# Altium schematic sheet Zusammenbau.SchDoc
size A0; SheetNumber: 1; SheetTotal: 3
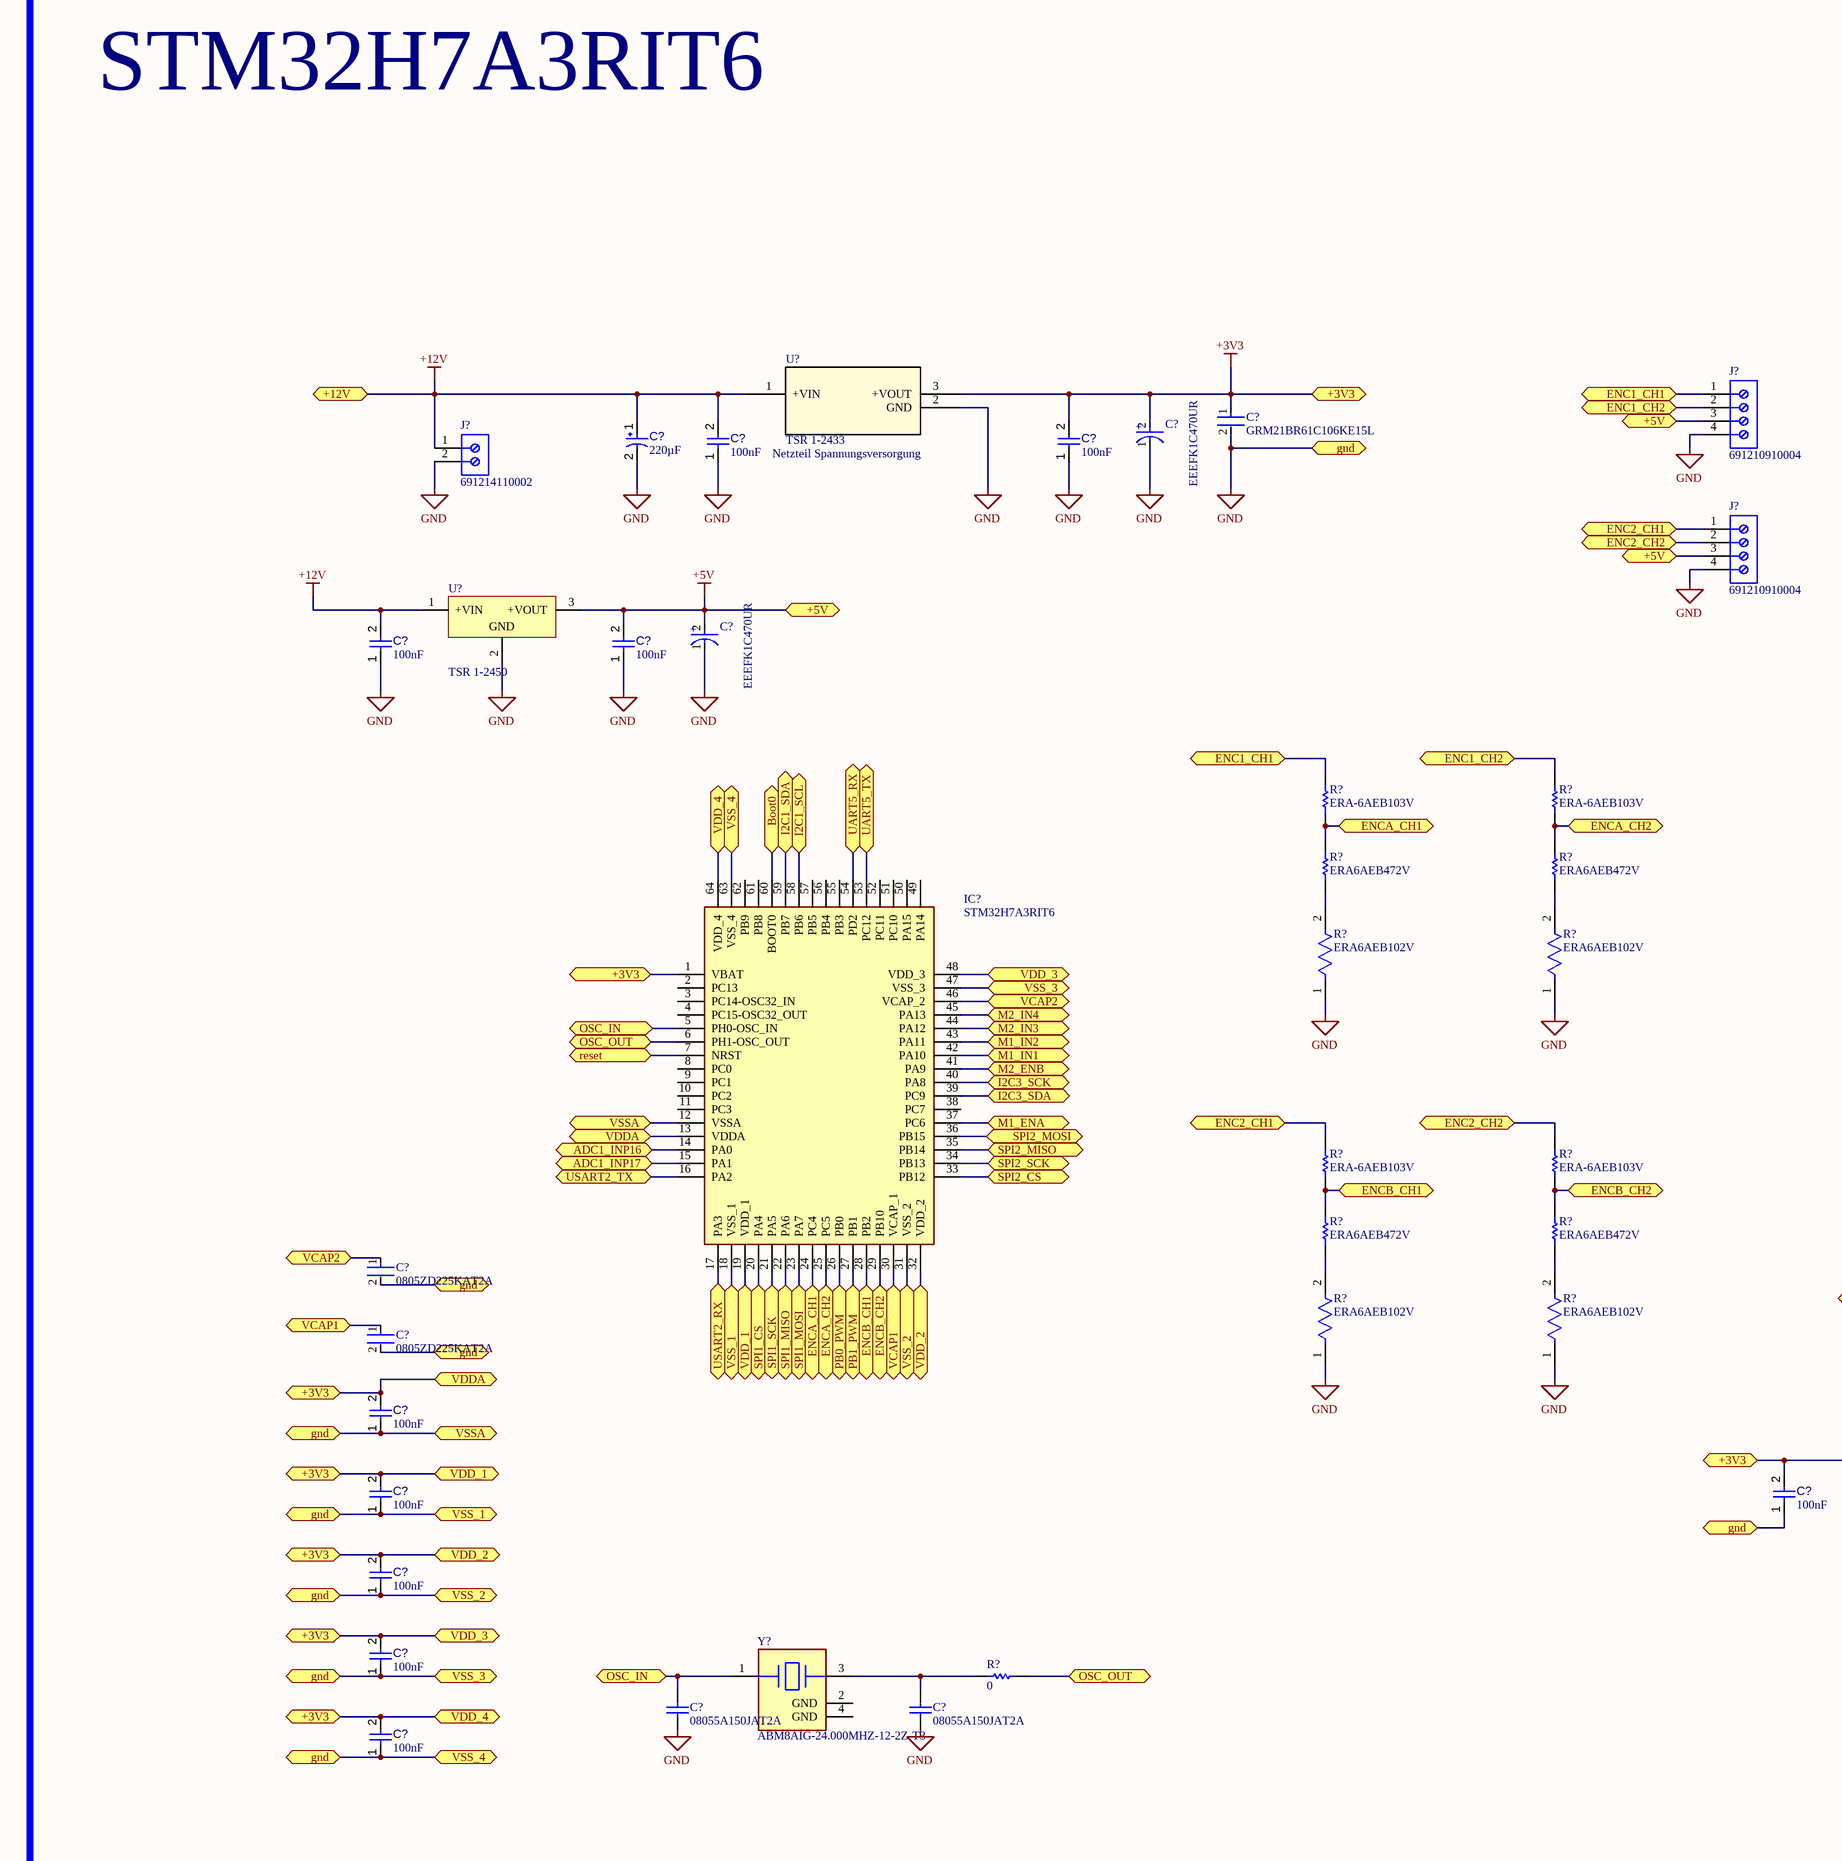
[diagram p0: Zusammenbau.SchDoc, left]
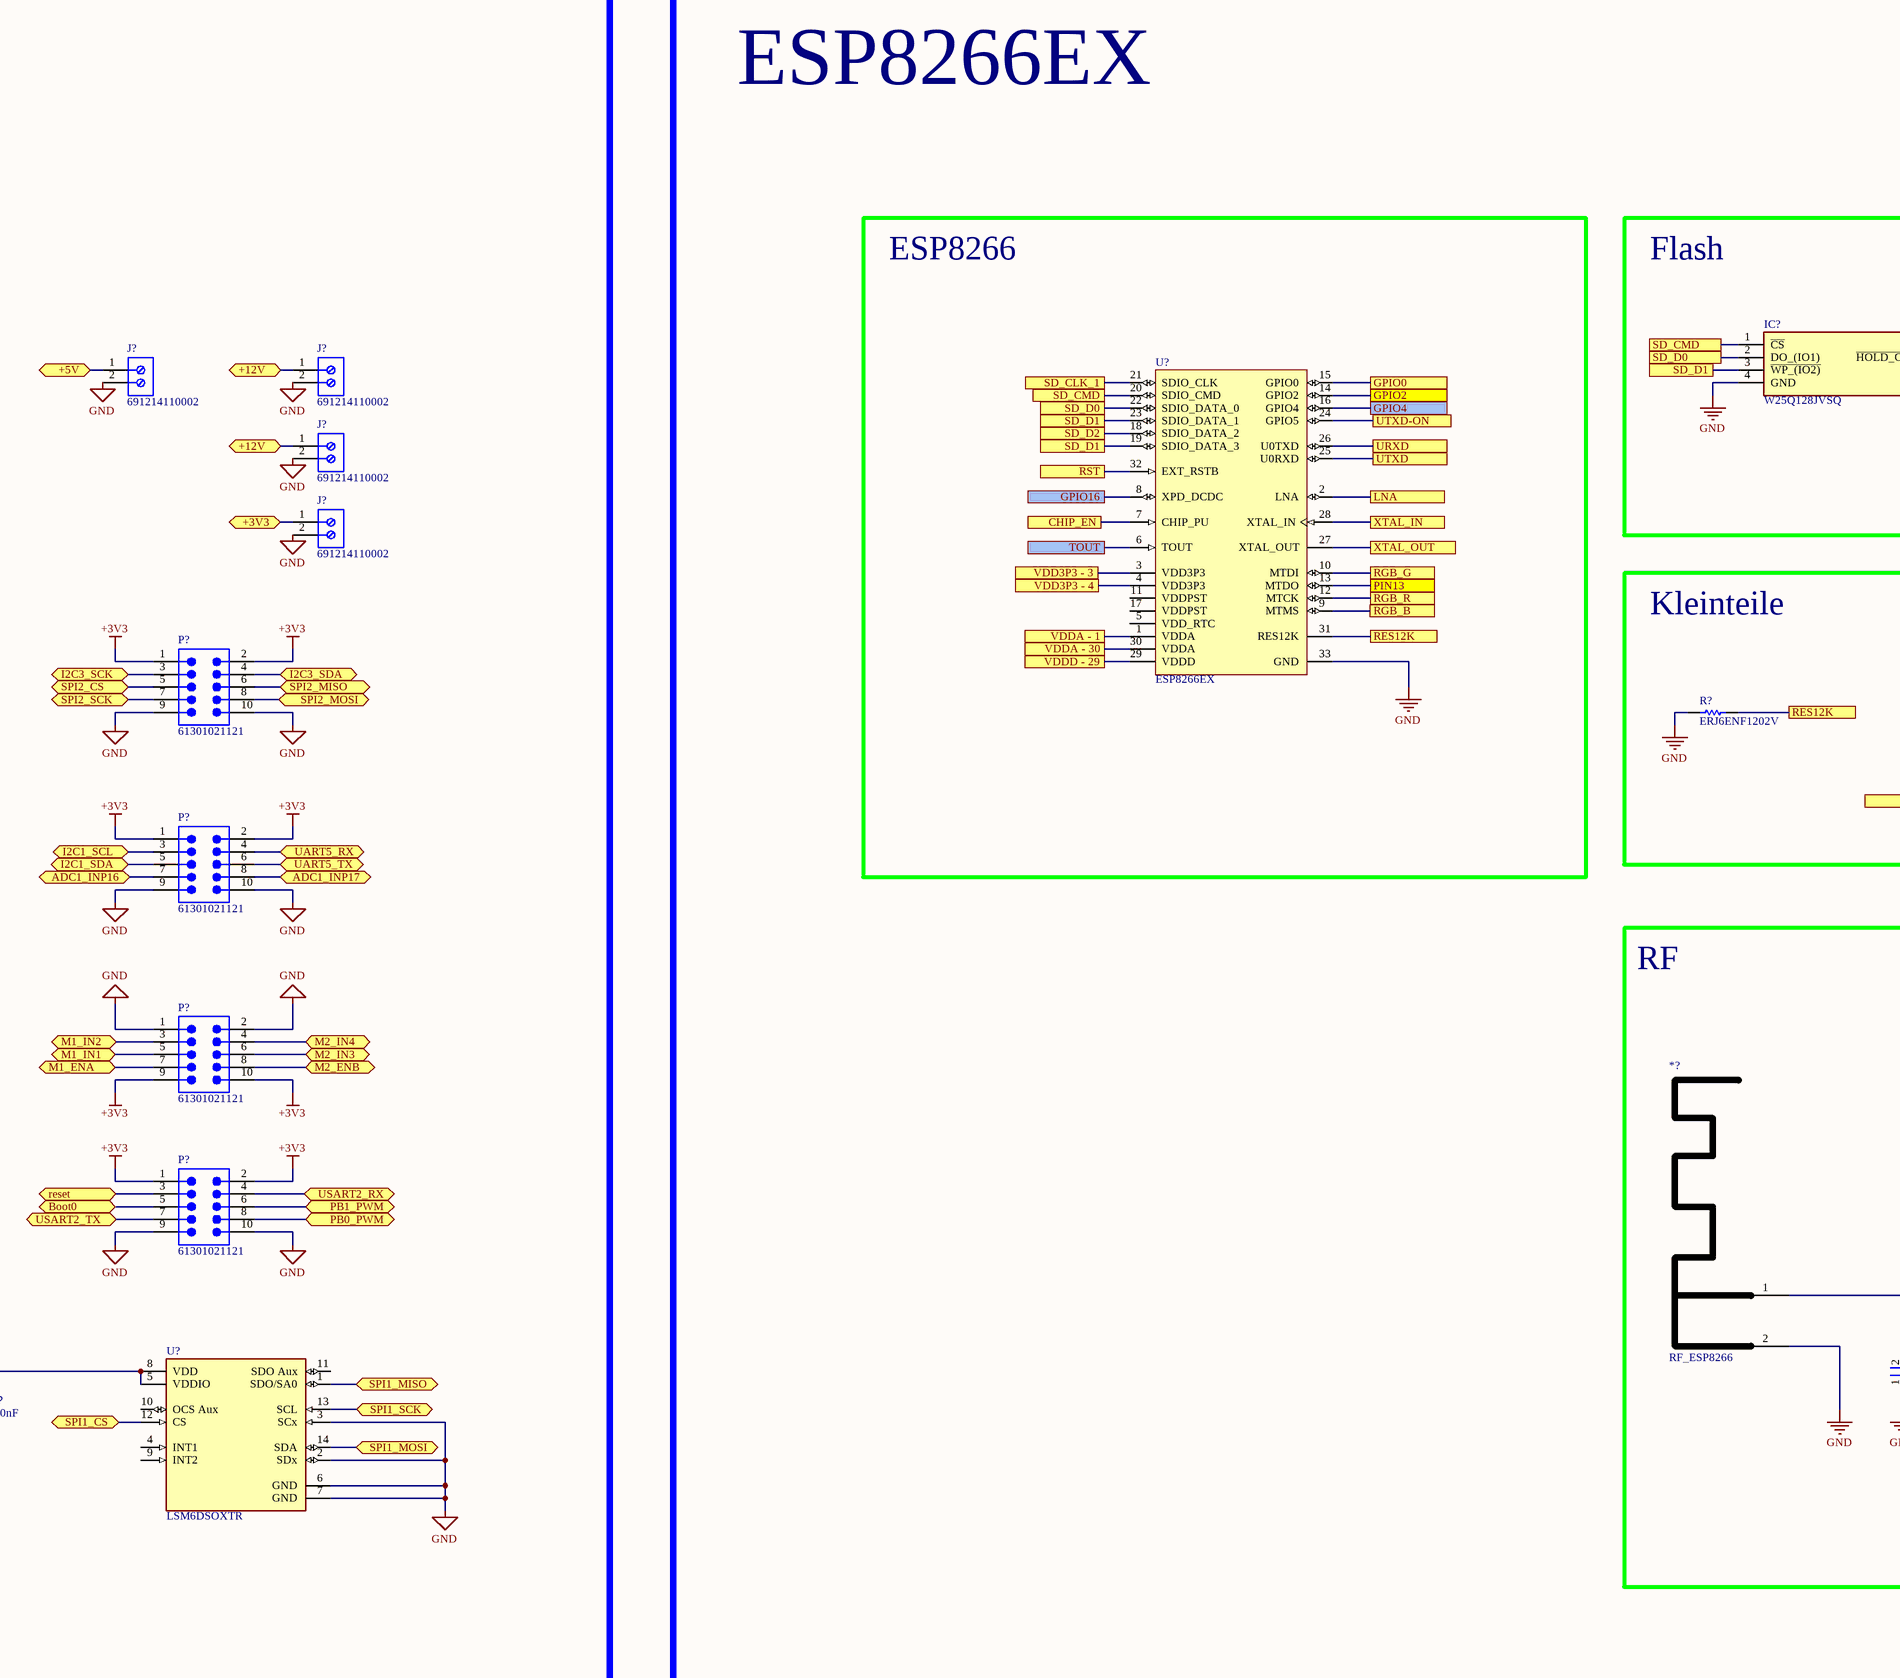
[diagram p1: Zusammenbau.SchDoc, middle]
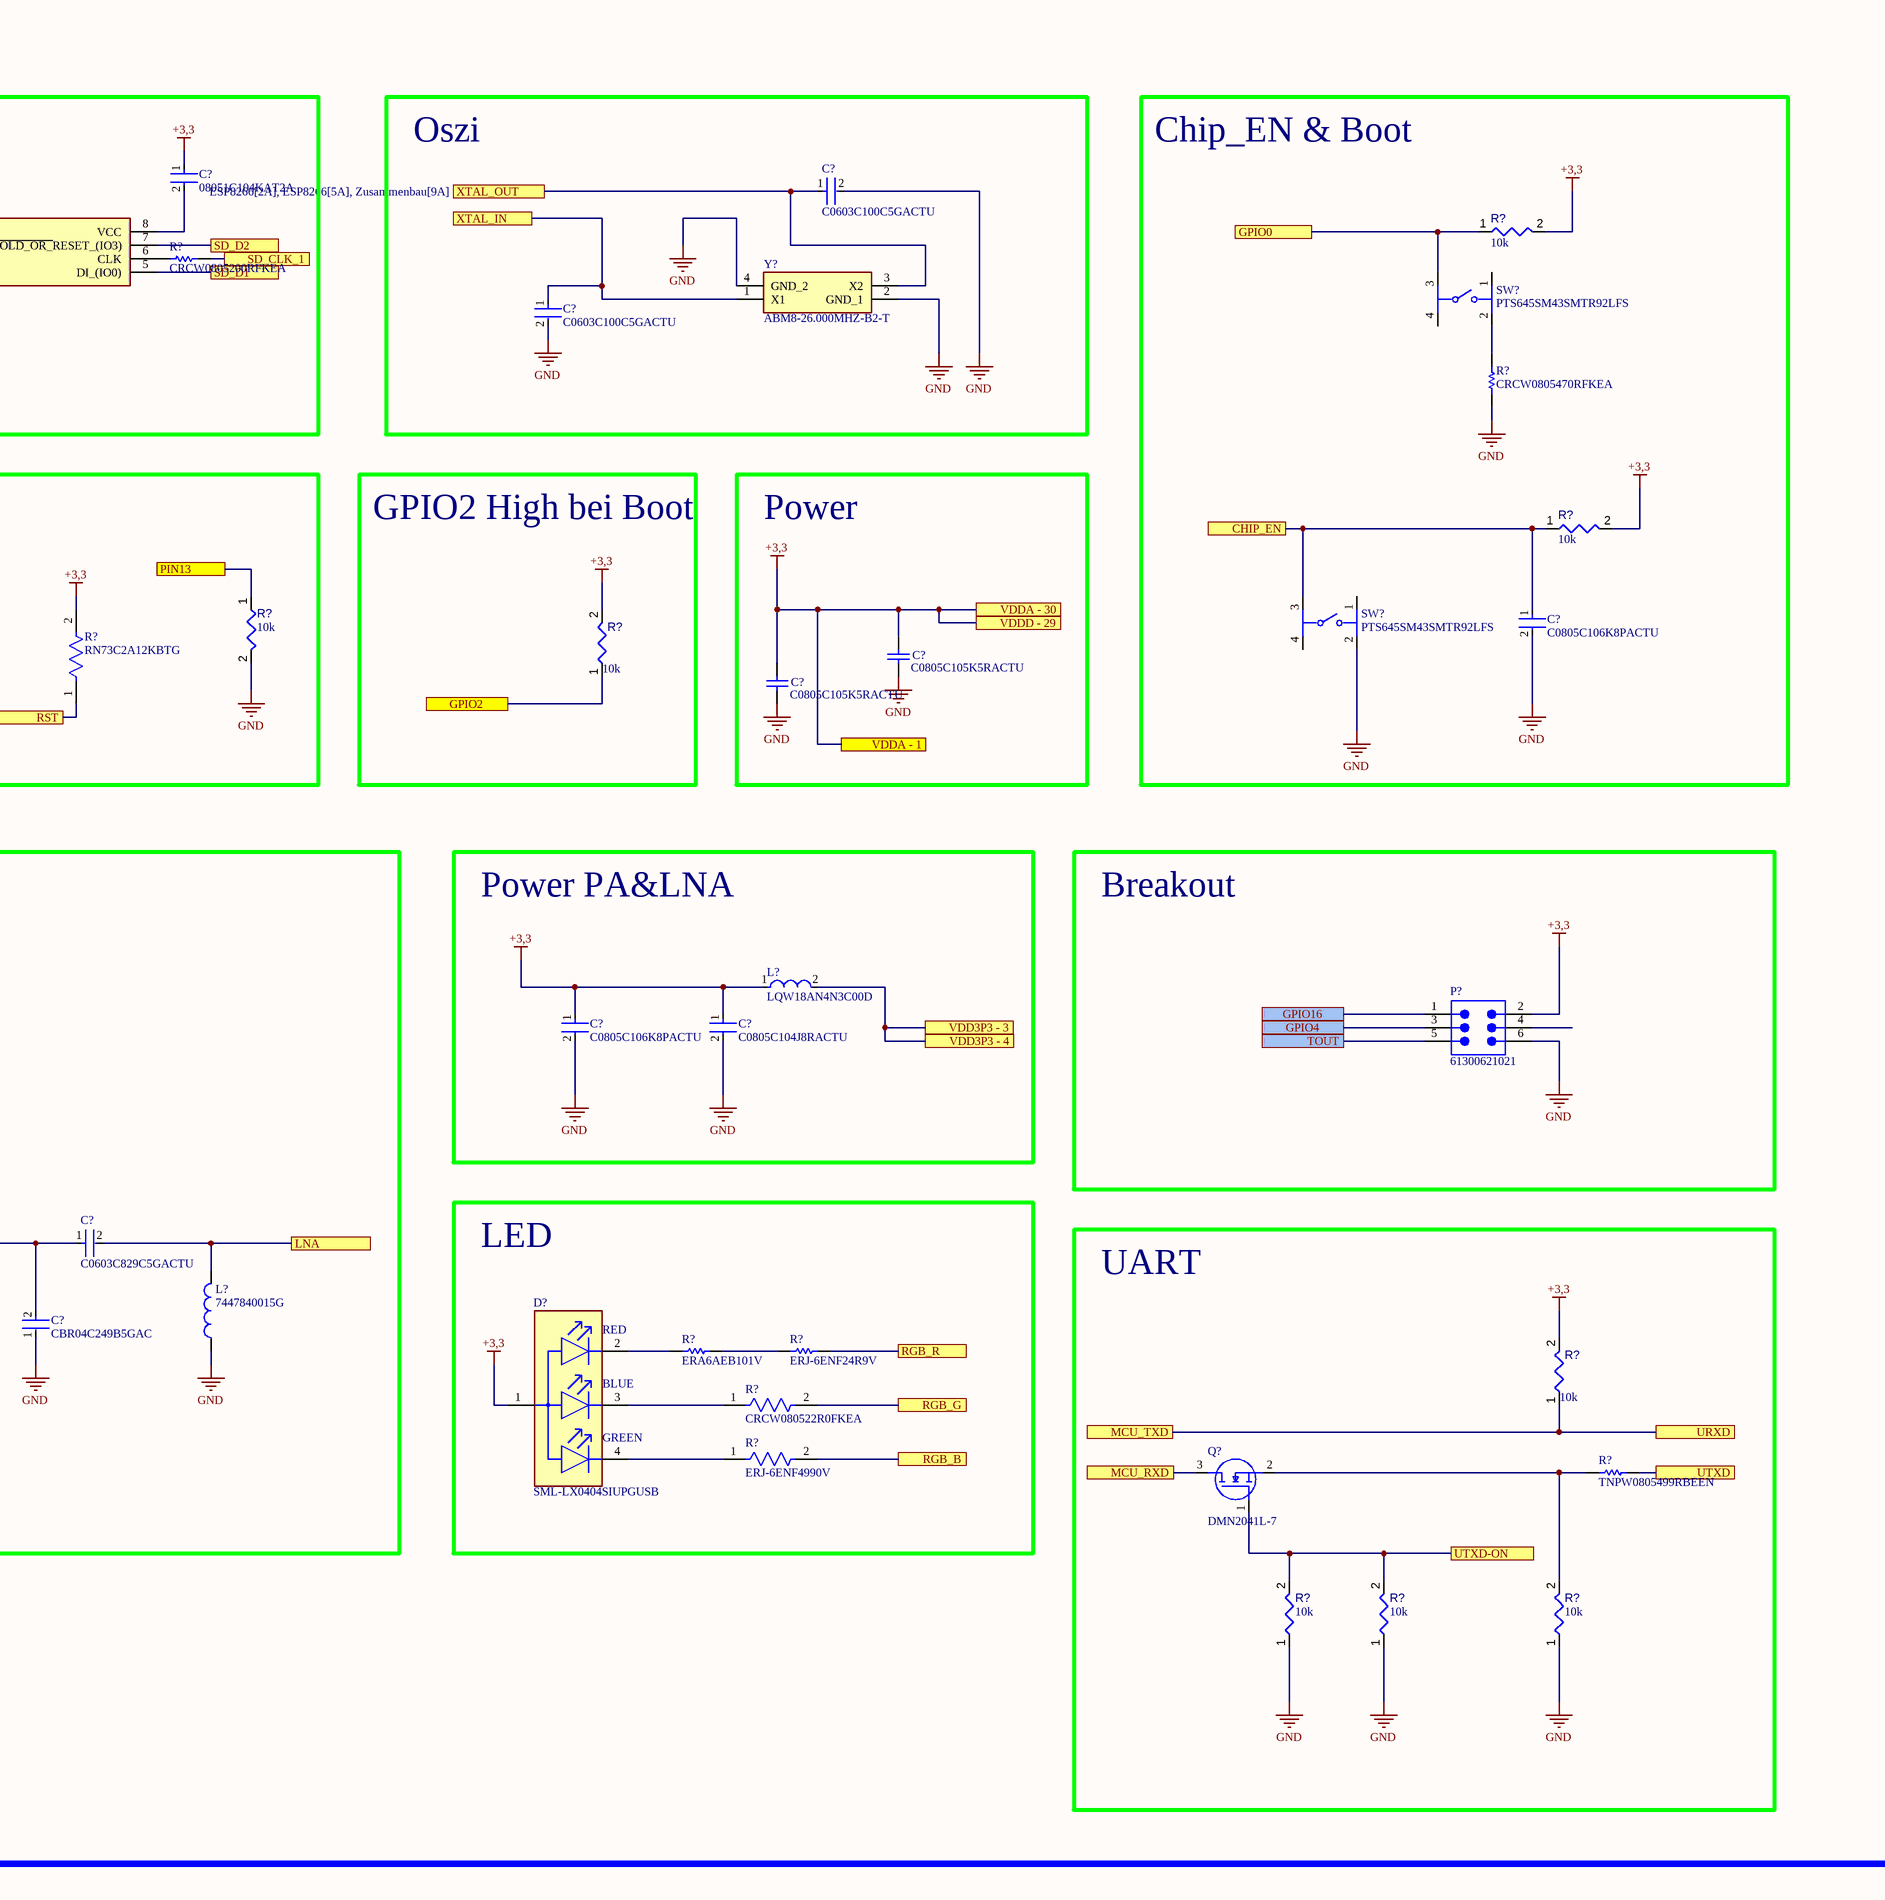
[diagram p2: Zusammenbau.SchDoc, right]

## Parts
(Parts that share a designator on the sheet are numbered #1, #2 ... from top to bottom, then left to right.)
*?  RF_ESP8266  [PCBComponent_1]
C?#1  08051C104KAT2A  [FP-0805-L_2_01_0_2-W_1_25-IPC_B]
C?#2  C0603C100C5GACTU  [FP-C0603C-CF-MFG]
C?#3  GRM21BR61C106KE15L  [FP-GRM21B-0_1-IPC_C]
C?#4  value 220µF  [CAPPR65-500-1250X1000X1350]  (hidden comment: ECA-1HM221)
C?#5  EEEFK1C470UR  [FP-FKC-MFG]
C?#6  C0603C100C5GACTU  [FP-C0603C-CF-MFG]
C?#7  value 100nF  [CAPC2013X95X50LL10T25]  (hidden comment: Capacitor 100 nF +/-10% 50 V 0805)
C?#8  value 100nF  [CAPC2013X95X50LL10T25]  (hidden comment: Capacitor 100 nF +/-10% 50 V 0805)
C?#9  EEEFK1C470UR  [FP-FKC-MFG]
C?#10  value 100nF  [CAPC2013X95X50LL10T25]  (hidden comment: Capacitor 100 nF +/-10% 50 V 0805)
C?#11  value 100nF  [CAPC2013X95X50LL10T25]  (hidden comment: Capacitor 100 nF +/-10% 50 V 0805)
C?#12  C0805C106K8PACTU  [FP-C0805C-DG-MFG]
C?#13  C0805C105K5RACTU  [CAPC2013X140X50ML20T25]
C?#14  C0805C105K5RACTU  [CAPC2013X140X50ML20T25]
C?#15  C0805C106K8PACTU  [FP-C0805C-DG-MFG]
C?#16  C0805C104J8RACTU  [FP-C0805C-DN-MFG]
C?#17  0805ZD225KAT2A  [FP-0805-L_2_01_0_2-W_1_25-IPC_B]
C?#18  0805ZD225KAT2A  [FP-0805-L_2_01_0_2-W_1_25-IPC_B]
C?#19  C0603C829C5GACTU  [FP-C0603C-CF-MFG]
C?#20  value 100nF  [CAPC2013X95X50LL10T25]  (hidden comment: Capacitor 100 nF +/-10% 50 V 0805)
C?#21  CBR04C249B5GAC  [FP-CBR04C-MFG]
C?#22  value 100nF  [CAPC2013X95X50LL10T25]  (hidden comment: Capacitor 100 nF +/-10% 50 V 0805)
C?#23  value 100nF  [CAPC2013X95X50LL10T25]  (hidden comment: Capacitor 100 nF +/-10% 50 V 0805)
C?#24  value 100nF  [CAPC2013X95X50LL10T25]  (hidden comment: Capacitor 100 nF +/-10% 50 V 0805)
C?#25  value 100nF  [CAPC2013X95X50LL10T25]  (hidden comment: Capacitor 100 nF +/-10% 50 V 0805)
C?#26  08055A150JAT2A  [CAPC2013X140X50LL20T25]
C?#27  08055A150JAT2A  [CAPC2013X140X50LL20T25]
C?#28  value 100nF  [CAPC2013X95X50LL10T25]  (hidden comment: Capacitor 100 nF +/-10% 50 V 0805)
D?  SML-LX0404SIUPGUSB  [FP-SML-LX0404SIUPGUSB-MFG]
IC?#1  W25Q128JVSQ  [SOIC127P790X216-8N]
IC?#2  STM32H7A3RIT6  [QFP50P1200X1200X160-64N]
J?#1  691210910004  [691210910004]
J?#2  691214110002  [691214110002]
J?#3  691214110002  [691214110002]
J?#4  691214110002  [691214110002]
J?#5  691214110002  [691214110002]
J?#6  691210910004  [691210910004]
J?#7  691214110002  [691214110002]
L?#1  LQW18AN4N3C00D  [FP-LQW18AN_00-MFG]
L?#2  7447840015G  [WE-MK_0402_L1W0.5H0.5]
P?#1  61301021121  [61301021121]
P?#2  61301021121  [61301021121]
P?#3  61301021121  [61301021121]
P?#4  61300621021  [61300621021]
P?#5  61301021121  [61301021121]
Q?  DMN2041L-7  [SOT96P240X110-3N]
R?#1  value 10k  [RESC2013X50X35ML15T15]  (hidden comment: Resistor 10k +/-1% 0805 125 mW)
R?#2  CRCW0805200RFKEA  [RESC2013X50X30NL20T20]
R?#3  CRCW0805470RFKEA  [RESC2013X50X30LL20T20]
R?#4  value 10k  [RESC2013X50X35ML15T15]  (hidden comment: Resistor 10k +/-1% 0805 125 mW)
R?#5  value 10k  [RESC2013X50X35ML15T15]  (hidden comment: Resistor 10k +/-1% 0805 125 mW)
R?#6  ERJ6ENF1202V  [RESC2013X70X40ML20T20]
R?#7  ERA-6AEB103V  [RESC2013X60X40LL20T25_A]
R?#8  ERA-6AEB103V  [RESC2013X60X40LL20T25_A]
R?#9  value 10k  [RESC2013X50X35ML15T15]  (hidden comment: Resistor 10k +/-1% 0805 125 mW)
R?#10  RN73C2A12KBTG  [FP-RN732A-MFG]
R?#11  ERA6AEB472V  [RESC2013X60X40ML20T25]
R?#12  ERA6AEB472V  [RESC2013X60X40ML20T25]
R?#13  ERA6AEB102V  [FP-ERA6A-IPC_C]
R?#14  ERA6AEB102V  [FP-ERA6A-IPC_C]
R?#15  ERA-6AEB103V  [RESC2013X60X40LL20T25_A]
R?#16  ERA-6AEB103V  [RESC2013X60X40LL20T25_A]
R?#17  ERA6AEB472V  [RESC2013X60X40ML20T25]
R?#18  ERA6AEB472V  [RESC2013X60X40ML20T25]
R?#19  ERA6AEB102V  [FP-ERA6A-IPC_C]
R?#20  ERA6AEB102V  [FP-ERA6A-IPC_C]
R?#21  ERA6AEB101V  [RESC2013X60X40ML20T25]
R?#22  ERJ-6ENF24R9V  [RESC2013X70X40ML20T20]
R?#23  CRCW080522R0FKEA  [FP-CRCW0805-e3-IPC_C]
R?#24  value 10k  [RESC2013X50X35ML15T15]  (hidden comment: Resistor 10k +/-1% 0805 125 mW)
R?#25  ERJ-6ENF4990V  [FP-ERJ6EN-IPC_B]
R?#26  TNPW0805499RBEEN  [RESC2013X55X40NL15T20]
R?#27  value 0  [RESC2013X60X35ML10T20]  (hidden comment: Resistor 0R +/- 5% 0805 125 mW)
R?#28  value 10k  [RESC2013X50X35ML15T15]  (hidden comment: Resistor 10k +/-1% 0805 125 mW)
R?#29  value 10k  [RESC2013X50X35ML15T15]  (hidden comment: Resistor 10k +/-1% 0805 125 mW)
R?#30  value 10k  [RESC2013X50X35ML15T15]  (hidden comment: Resistor 10k +/-1% 0805 125 mW)
SW?#1  PTS645SM43SMTR92LFS  [FP-PTS645SM43SMTR92LFS-MFG]
SW?#2  PTS645SM43SMTR92LFS  [FP-PTS645SM43SMTR92LFS-MFG]
U?#1  TSR 1-2433  [TSR1-SINGLE_TRP]
U?#2  ESP8266EX  [ESFS-QFN-32_L]
U?#3  TSR 1-2450  [TRACO-SIP-3_V]
U?#4  LSM6DSOXTR  [FP-LGA-14L-DM00249496-MFG]
Y?#1  ABM8-26.000MHZ-B2-T  [ABM810000MHZ12D2W]
Y?#2  ABM8AIG-24.000MHZ-12-2Z-T3  [FP-ABM8AIG-MFG]

## Blocks framed on the sheet
STM32H7A3RIT6: C?#3-C?#5 C?#7-C?#11 C?#17 C?#18 C?#20 C?#22-C?#28 IC?#2 J?#1-J?#7 P?#1-P?#3 P?#5 R?#7 R?#8 R?#11-R?#20 R?#27 U?#1 U?#3 U?#4 Y?#2
ESP8266: U?#2
Flash: C?#1 IC?#1 R?#2
Oszi: C?#2 C?#6 Y?#1
Chip_EN & Boot: C?#12 R?#1 R?#3 R?#4 SW?#1 SW?#2
Kleinteile: R?#5 R?#6 R?#10
GPIO2 High bei Boot: R?#9
Power: C?#13 C?#14
RF: *? C?#19 C?#21 L?#2
Power PA&LNA: C?#15 C?#16 L?#1
Breakout: P?#4
LED: D? R?#21-R?#23 R?#25
UART: Q? R?#24 R?#26 R?#28-R?#30

## Ports
+3V3 (bidir, see stm32_schematic[1C], stm32_schematic[1D], stm32_schematic[2B], stm32_schematic[5A], stm32_schematic[6D], stm32_schematic[7A], Zusammenbau[2B], Zusammenbau[4A], Zusammenbau[5B]), +3V3 (bidir, see stm32_schematic[1C], stm32_schematic[1D], stm32_schematic[2B], stm32_schematic[5A], stm32_schematic[6D], stm32_schematic[7A], Zusammenbau[2B], Zusammenbau[4A], Zusammenbau[5B], Zusammenbau[6A]), +3V3 (bidir, see stm32_schematic[1C], stm32_schematic[1D], stm32_schematic[2B], stm32_schematic[5A], stm32_schematic[6D], stm32_schematic[7A], Zusammenbau[2B], Zusammenbau[4A], Zusammenbau[6A]), +3V3 (bidir, see stm32_schematic[1C], stm32_schematic[1D], stm32_schematic[2B], stm32_schematic[5A], stm32_schematic[6D], stm32_schematic[7A], Zusammenbau[2B], Zusammenbau[5B], Zusammenbau[6A]), +5V (bidir, see stm32_schematic[3A], stm32_schematic[6A], stm32_schematic[7A], Zusammenbau[3A], Zusammenbau[5A]), +5V (bidir, see stm32_schematic[3A], stm32_schematic[6A], stm32_schematic[7A], Zusammenbau[3A], Zusammenbau[5A], Zusammenbau[6A]), +5V (bidir, see stm32_schematic[3A], stm32_schematic[6A], stm32_schematic[7A], Zusammenbau[5A], Zusammenbau[6A]), +12V (bidir, see stm32_schematic[1A], stm32_schematic[7A], Zusammenbau[2A], Zusammenbau[6A]), +12V (bidir, see stm32_schematic[1A], stm32_schematic[7A], Zusammenbau[6A]), ADC1_INP16 (bidir, see stm32_schematic[2C], stm32_schematic[7B], Zusammenbau[2B]), ADC1_INP16 (bidir, see stm32_schematic[2C], stm32_schematic[7B], Zusammenbau[6B]), ADC1_INP17 (bidir, see stm32_schematic[2C], stm32_schematic[8B], Zusammenbau[2B]), ADC1_INP17 (bidir, see stm32_schematic[2C], stm32_schematic[8B], Zusammenbau[6B]), Boot0 (bidir, see stm32_schematic[3B], stm32_schematic[7C], Zusammenbau[3A]), Boot0 (bidir, see stm32_schematic[3B], stm32_schematic[7C], Zusammenbau[6B]), CHIP_EN (see ESP8266[1A], ESP8266[7A], Zusammenbau[9A]), CHIP_EN (see ESP8266[1A], ESP8266[7A], Zusammenbau[14A]), ENC1_CH1 (bidir, see stm32_schematic[4B], stm32_schematic[6A], Zusammenbau[4A]), ENC1_CH1 (bidir, see stm32_schematic[4B], stm32_schematic[6A], Zusammenbau[5A]), ENC1_CH2 (bidir, see stm32_schematic[5B], stm32_schematic[6A], Zusammenbau[5A]), ENC2_CH1 (bidir, see stm32_schematic[4C], stm32_schematic[6A], Zusammenbau[4B]), ENC2_CH1 (bidir, see stm32_schematic[4C], stm32_schematic[6A], Zusammenbau[5A]), ENC2_CH2 (bidir, see stm32_schematic[5C], stm32_schematic[6A], Zusammenbau[5A]), ENC2_CH2 (bidir, see stm32_schematic[5C], stm32_schematic[6A], Zusammenbau[5B]), ENCA_CH1 (bidir, see stm32_schematic[3C], stm32_schematic[5B], Zusammenbau[3B]), ENCA_CH1 (bidir, see stm32_schematic[3C], stm32_schematic[5B], Zusammenbau[4A]), ENCA_CH2 (bidir, see stm32_schematic[3C], stm32_schematic[6B], Zusammenbau[3B]), ENCA_CH2 (bidir, see stm32_schematic[3C], stm32_schematic[6B], Zusammenbau[5A]), ENCB_CH1 (bidir, see stm32_schematic[3C], stm32_schematic[5C], Zusammenbau[3B]), ENCB_CH1 (bidir, see stm32_schematic[3C], stm32_schematic[5C], Zusammenbau[4B]), ENCB_CH2 (bidir, see stm32_schematic[3C], stm32_schematic[6C], Zusammenbau[3B]), ENCB_CH2 (bidir, see stm32_schematic[3C], stm32_schematic[6C], Zusammenbau[5B]), gnd (bidir, see stm32_schematic[1C], stm32_schematic[1D], stm32_schematic[5A], stm32_schematic[6D], Zusammenbau[2B], Zusammenbau[4A]), gnd (bidir, see stm32_schematic[1C], stm32_schematic[1D], stm32_schematic[5A], stm32_schematic[6D], Zusammenbau[2B], Zusammenbau[4A], Zusammenbau[5B]), gnd (bidir, see stm32_schematic[1C], stm32_schematic[1D], stm32_schematic[5A], stm32_schematic[6D], Zusammenbau[2B], Zusammenbau[5B]), GPIO0 (see ESP8266[2A], ESP8266[7A], Zusammenbau[9A]), GPIO0 (see ESP8266[2A], ESP8266[7A], Zusammenbau[14A]), GPIO2 (see ESP8266[2A], ESP8266[5B], Zusammenbau[9A]), GPIO2 (see ESP8266[2A], ESP8266[5B], Zusammenbau[12A]), GPIO4 (see ESP8266[2A], ESP8266[7B], Zusammenbau[9A]), GPIO4 (see ESP8266[2A], ESP8266[7B], Zusammenbau[14B]), GPIO16 (see ESP8266[1A], ESP8266[7B], Zusammenbau[9A]), GPIO16 (see ESP8266[1A], ESP8266[7B], Zusammenbau[14B]), I2C1_SCL (bidir, see stm32_schematic[3B], stm32_schematic[7B], Zusammenbau[3A]), I2C1_SCL (bidir, see stm32_schematic[3B], stm32_schematic[7B], Zusammenbau[6A]), I2C1_SDA (bidir, see stm32_schematic[3B], stm32_schematic[7B], Zusammenbau[3A]), I2C1_SDA (bidir, see stm32_schematic[3B], stm32_schematic[7B], Zusammenbau[6A]), I2C3_SCK (bidir, see stm32_schematic[3C], stm32_schematic[7B], Zusammenbau[3B]), I2C3_SCK (bidir, see stm32_schematic[3C], stm32_schematic[7B], Zusammenbau[6A]), I2C3_SDA (bidir, see stm32_schematic[3C], stm32_schematic[8B], Zusammenbau[3B]), I2C3_SDA (bidir, see stm32_schematic[3C], stm32_schematic[8B], Zusammenbau[6A]), LNA (see ESP8266[2A], ESP8266[4C], Zusammenbau[9A]), LNA (see ESP8266[2A], ESP8266[4C], Zusammenbau[12B]), M1_ENA (bidir, see stm32_schematic[3C], stm32_schematic[7C], Zusammenbau[3B]), M1_ENA (bidir, see stm32_schematic[3C], stm32_schematic[7C], Zusammenbau[6B]), M1_IN1 (bidir, see stm32_schematic[3B], stm32_schematic[7C], Zusammenbau[3B]), M1_IN1 (bidir, see stm32_schematic[3B], stm32_schematic[7C], Zusammenbau[6B]), M1_IN2 (bidir, see stm32_schematic[3B], stm32_schematic[7C], Zusammenbau[3B]), M1_IN2 (bidir, see stm32_schematic[3B], stm32_schematic[7C], Zusammenbau[6B]), M2_ENB (bidir, see stm32_schematic[3C], stm32_schematic[8C], Zusammenbau[3B]), M2_ENB (bidir, see stm32_schematic[3C], stm32_schematic[8C], Zusammenbau[6B]), M2_IN3 (bidir, see stm32_schematic[3B], stm32_schematic[8C], Zusammenbau[3B]), M2_IN3 (bidir, see stm32_schematic[3B], stm32_schematic[8C], Zusammenbau[6B]), M2_IN4 (bidir, see stm32_schematic[3B], stm32_schematic[8C], Zusammenbau[3B]), M2_IN4 (bidir, see stm32_schematic[3B], stm32_schematic[8C], Zusammenbau[6B]), MCU_RXD (see ESP8266[6C]), MCU_TXD (see ESP8266[6C]), OSC_IN (bidir, see stm32_schematic[2B], stm32_schematic[2D], Zusammenbau[2B]), OSC_OUT (bidir, see stm32_schematic[2B], stm32_schematic[4D], Zusammenbau[2B]), OSC_OUT (bidir, see stm32_schematic[2B], stm32_schematic[4D], Zusammenbau[4B]), PB0_PWM (bidir, see stm32_schematic[3C], stm32_schematic[8C], Zusammenbau[3B]), PB0_PWM (bidir, see stm32_schematic[3C], stm32_schematic[8C], Zusammenbau[6B]), PB1_PWM (bidir, see stm32_schematic[3C], stm32_schematic[8C], Zusammenbau[3B]), PB1_PWM (bidir, see stm32_schematic[3C], stm32_schematic[8C], Zusammenbau[6B]), PIN13 (see ESP8266[2A], ESP8266[4B], Zusammenbau[9A]), PIN13 (see ESP8266[2A], ESP8266[4B], Zusammenbau[11A]), RES12K (see ESP8266[2A], ESP8266[3B], Zusammenbau[9A]), RES12K (see ESP8266[2A], ESP8266[3B], Zusammenbau[11A]), reset (bidir, see stm32_schematic[2B], stm32_schematic[7C], Zusammenbau[2B]), reset (bidir, see stm32_schematic[2B], stm32_schematic[7C], Zusammenbau[6B]), RGB_B (see ESP8266[2A], ESP8266[6C], Zusammenbau[9A]), RGB_B (see ESP8266[2A], ESP8266[6C], Zusammenbau[13B]), RGB_G (see ESP8266[2A], ESP8266[6C], Zusammenbau[9A]), RGB_G (see ESP8266[2A], ESP8266[6C], Zusammenbau[13B]), RGB_R (see ESP8266[2A], ESP8266[6C], Zusammenbau[9A]), RGB_R (see ESP8266[2A], ESP8266[6C], Zusammenbau[13B]), RST (see ESP8266[1A], ESP8266[4B], Zusammenbau[9A]), RST (see ESP8266[1A], ESP8266[4B], Zusammenbau[11A]), SD_CLK_1 (see ESP8266[1A], ESP8266[4A], Zusammenbau[8A]), SD_CLK_1 (see ESP8266[1A], ESP8266[4A], Zusammenbau[11A]), SD_CMD (see ESP8266[1A], ESP8266[3A], Zusammenbau[9A]), SD_CMD (see ESP8266[1A], ESP8266[3A], Zusammenbau[10A]), SD_D0 (see ESP8266[1A], ESP8266[3A], Zusammenbau[9A]), SD_D0 (see ESP8266[1A], ESP8266[3A], Zusammenbau[10A]), SD_D1 (see ESP8266[1A], ESP8266[3A], ESP8266[4A], Zusammenbau[9A], Zusammenbau[10A]), SD_D1 (see ESP8266[1A], ESP8266[3A], ESP8266[4A], Zusammenbau[9A], Zusammenbau[10A], Zusammenbau[11A]), SD_D1 (see ESP8266[1A], ESP8266[3A], ESP8266[4A], Zusammenbau[9A], Zusammenbau[11A]), SD_D2 (see ESP8266[1A], ESP8266[4A], Zusammenbau[9A]), SD_D2 (see ESP8266[1A], ESP8266[4A], Zusammenbau[11A]), SPI1_CS (bidir, see stm32_schematic[2C], stm32_schematic[7D], Zusammenbau[3B]), SPI1_CS (bidir, see stm32_schematic[2C], stm32_schematic[7D], Zusammenbau[6B]), SPI1_MISO (bidir, see stm32_schematic[3C], stm32_schematic[8D], Zusammenbau[3B]), SPI1_MISO (bidir, see stm32_schematic[3C], stm32_schematic[8D], Zusammenbau[7B]), SPI1_MOSI (bidir, see stm32_schematic[3C], stm32_schematic[8D], Zusammenbau[3B]), SPI1_MOSI (bidir, see stm32_schematic[3C], stm32_schematic[8D], Zusammenbau[7B]), SPI1_SCK (bidir, see stm32_schematic[3C], stm32_schematic[8D], Zusammenbau[3B]), SPI1_SCK (bidir, see stm32_schematic[3C], stm32_schematic[8D], Zusammenbau[7B]), SPI2_CS (bidir, see stm32_schematic[3C], stm32_schematic[7B], Zusammenbau[3B]), SPI2_CS (bidir, see stm32_schematic[3C], stm32_schematic[7B], Zusammenbau[6A]), SPI2_MISO (bidir, see stm32_schematic[3C], stm32_schematic[8B], Zusammenbau[3B]), SPI2_MISO (bidir, see stm32_schematic[3C], stm32_schematic[8B], Zusammenbau[6A]), SPI2_MOSI (bidir, see stm32_schematic[3C], stm32_schematic[8B], Zusammenbau[3B]), SPI2_MOSI (bidir, see stm32_schematic[3C], stm32_schematic[8B], Zusammenbau[6A]), SPI2_SCK (bidir, see stm32_schematic[3C], stm32_schematic[7B], Zusammenbau[3B]), SPI2_SCK (bidir, see stm32_schematic[3C], stm32_schematic[7B], Zusammenbau[6A]), TOUT (see ESP8266[1A], ESP8266[7B], Zusammenbau[9A]), TOUT (see ESP8266[1A], ESP8266[7B], Zusammenbau[14B]), UART5_RX (bidir, see stm32_schematic[3B], stm32_schematic[8B], Zusammenbau[3A]), UART5_RX (bidir, see stm32_schematic[3B], stm32_schematic[8B], Zusammenbau[6A]), UART5_TX (bidir, see stm32_schematic[3B], stm32_schematic[8B], Zusammenbau[3A]), UART5_TX (bidir, see stm32_schematic[3B], stm32_schematic[8B], Zusammenbau[6A]), URXD (see ESP8266[2A], ESP8266[8C], Zusammenbau[9A]), URXD (see ESP8266[2A], ESP8266[8C], Zusammenbau[15B]), USART2_RX (bidir, see stm32_schematic[2C], stm32_schematic[8C], Zusammenbau[3B]), USART2_RX (bidir, see stm32_schematic[2C], stm32_schematic[8C], Zusammenbau[6B]), USART2_TX (bidir, see stm32_schematic[2C], stm32_schematic[7C], Zusammenbau[2B]), USART2_TX (bidir, see stm32_schematic[2C], stm32_schematic[7C], Zusammenbau[6B]), UTXD (see ESP8266[2A], ESP8266[8C], Zusammenbau[9A]), UTXD (see ESP8266[2A], ESP8266[8C], Zusammenbau[15B]), UTXD-ON (see ESP8266[2A], ESP8266[7C], Zusammenbau[9A]), UTXD-ON (see ESP8266[2A], ESP8266[7C], Zusammenbau[15B]), VCAP1 (bidir, see stm32_schematic[1C], stm32_schematic[3C], Zusammenbau[2B]), VCAP1 (bidir, see stm32_schematic[1C], stm32_schematic[3C], Zusammenbau[3B]), VCAP2 (bidir, see stm32_schematic[1C], stm32_schematic[3B], Zusammenbau[2B]), VCAP2 (bidir, see stm32_schematic[1C], stm32_schematic[3B], Zusammenbau[3B]), VDD3P3 - 3 (see ESP8266[1A], ESP8266[6B], Zusammenbau[8A]), VDD3P3 - 3 (see ESP8266[1A], ESP8266[6B], Zusammenbau[13B]), VDD3P3 - 4 (see ESP8266[1A], ESP8266[6B], Zusammenbau[8A]), VDD3P3 - 4 (see ESP8266[1A], ESP8266[6B], Zusammenbau[13B]), VDD_1 (bidir, see stm32_schematic[1D], stm32_schematic[2C], Zusammenbau[2B]), VDD_1 (bidir, see stm32_schematic[1D], stm32_schematic[2C], Zusammenbau[3B]), VDD_2 (bidir, see stm32_schematic[1D], stm32_schematic[3C], Zusammenbau[2B]), VDD_2 (bidir, see stm32_schematic[1D], stm32_schematic[3C], Zusammenbau[3B]), VDD_3 (bidir, see stm32_schematic[1D], stm32_schematic[3B], Zusammenbau[2B]), VDD_3 (bidir, see stm32_schematic[1D], stm32_schematic[3B], Zusammenbau[3B]), VDD_4 (bidir, see stm32_schematic[1D], stm32_schematic[2B], Zusammenbau[2B]), VDD_4 (bidir, see stm32_schematic[1D], stm32_schematic[2B], Zusammenbau[3A]), VDDA (bidir, see stm32_schematic[1C], stm32_schematic[2C], Zusammenbau[2B]), VDDA - 1 (see ESP8266[1A], ESP8266[6B], Zusammenbau[8A]), VDDA - 1 (see ESP8266[1A], ESP8266[6B], Zusammenbau[13A]), VDDA - 30 (see ESP8266[1A], ESP8266[6B], Zusammenbau[8A]), VDDA - 30 (see ESP8266[1A], ESP8266[6B], Zusammenbau[13A]), VDDD - 29 (see ESP8266[1B], ESP8266[6B], Zusammenbau[8A]), VDDD - 29 (see ESP8266[1B], ESP8266[6B], Zusammenbau[13A]), VSS_1 (bidir, see stm32_schematic[1D], stm32_schematic[2C], Zusammenbau[2B]), VSS_1 (bidir, see stm32_schematic[1D], stm32_schematic[2C], Zusammenbau[3B]), VSS_2 (bidir, see stm32_schematic[1D], stm32_schematic[3C], Zusammenbau[2B]), VSS_2 (bidir, see stm32_schematic[1D], stm32_schematic[3C], Zusammenbau[3B]), VSS_3 (bidir, see stm32_schematic[1D], stm32_schematic[3B], Zusammenbau[2B]), VSS_3 (bidir, see stm32_schematic[1D], stm32_schematic[3B], Zusammenbau[3B]), VSS_4 (bidir, see stm32_schematic[1D], stm32_schematic[2B], Zusammenbau[2B]), VSS_4 (bidir, see stm32_schematic[1D], stm32_schematic[2B], Zusammenbau[3A]), VSSA (bidir, see stm32_schematic[1C], stm32_schematic[2C], Zusammenbau[2B]), XTAL_IN (see ESP8266[2A], ESP8266[5A], Zusammenbau[9A]), XTAL_IN (see ESP8266[2A], ESP8266[5A], Zusammenbau[12A]), XTAL_OUT (see ESP8266[2A], ESP8266[5A], Zusammenbau[9A]), XTAL_OUT (see ESP8266[2A], ESP8266[5A], Zusammenbau[12A])

## Nets
+3,3: C?#1.1 C?#13.2 C?#14.2 C?#15.1 C?#16.1 D?.1(Common_Anode) L?#1.1 P?#4.2 R?#1.2 R?#4.2 R?#9.2 R?#10.2 R?#24.2 U?#2.1(VDDA) U?#2.29(VDDD) U?#2.30(VDDA) ; port VDDA - 30, port VDDD - 29, port VDDA - 1
+3V3: C?#3.1 C?#5.2(A) C?#8.2 C?#20.2 C?#22.2 C?#23.2 C?#24.2 C?#25.2 C?#28.2 IC?#2.1(VBAT) IC?#2.13(VDDA) IC?#2.19(VDD_1) IC?#2.32(VDD_2) IC?#2.48(VDD_3) IC?#2.64(VDD_4) J?#7.1 P?#1.1 P?#1.2 P?#2.1 P?#2.2 P?#3.9 P?#3.10 P?#5.1 P?#5.2 U?#1.3(+VOUT) U?#4.5(VDDIO) U?#4.8(VDD) ; port VDDA, port +3V3, port VDD_1, port VDD_2, port VDD_3, port VDD_4
+5V: C?#9.2(A) C?#11.2 J?#1.3 J?#2.1 J?#6.3 U?#3.3(+VOUT) ; port +5V
+12V: C?#4.1 C?#7.2 C?#10.2 J?#3.1 J?#4.1 J?#5.1 U?#1.1(+VIN) U?#3.1(+VIN) ; port +12V
GND: *?.2(GND) C?#2.2 C?#3.2 C?#4.2 C?#5.1(C) C?#6.2 C?#7.1 C?#8.1 C?#9.1(C) C?#10.1 C?#11.1 C?#12.2 C?#13.1 C?#14.1 C?#15.2 C?#16.2 C?#17.2 C?#18.2 C?#20.1 C?#21.1 C?#22.1 C?#23.1 C?#24.1 C?#25.1 C?#26.1 C?#27.1 C?#28.1 IC?#1.4(GND) IC?#2.12(VSSA) IC?#2.18(VSS_1) IC?#2.31(VSS_2) IC?#2.47(VSS_3) IC?#2.63(VSS_4) J?#1.4 J?#2.2 J?#3.2 J?#4.2 J?#5.2 J?#6.4 J?#7.2 L?#2.1 P?#1.9 P?#1.10 P?#2.9 P?#2.10 P?#3.1 P?#3.2 P?#4.6 P?#5.9 P?#5.10 R?#3.1 R?#5.2 R?#6.1 R?#13.1 R?#14.1 R?#19.1 R?#20.1 R?#28.1 R?#29.1 R?#30.1 SW?#2.2 U?#1.2(GND) U?#2.33(GND) U?#3.2(GND) U?#4.2(SDx) U?#4.3(SCx) U?#4.6(GND) U?#4.7(GND) Y?#1.2(GND_1) Y?#1.4(GND_2) ; port VSSA, port gnd, port VSS_1, port VSS_2, port VSS_3, port VSS_4
ADC1_INP16: IC?#2.14(PA0) P?#2.7 ; port ADC1_INP16
ADC1_INP17: IC?#2.15(PA1) P?#2.8 ; port ADC1_INP17
Boot0: IC?#2.60(BOOT0) ; port Boot0
CHIP_EN: C?#12.1 R?#4.1 SW?#2.3 U?#2.7(CHIP_PU) ; port CHIP_EN
ENC1_CH1: J?#1.1 R?#7.2 ; port ENC1_CH1
ENC1_CH2: J?#1.2 R?#8.2 ; port ENC1_CH2
ENC2_CH1: J?#6.1 R?#15.2 ; port ENC2_CH1
ENC2_CH2: J?#6.2 R?#16.2 ; port ENC2_CH2
ENCA_CH1: IC?#2.24(PC4) R?#7.1 R?#11.2 ; port ENCA_CH1
ENCA_CH2: IC?#2.25(PC5) R?#8.1 R?#12.2 ; port ENCA_CH2
ENCB_CH1: IC?#2.28(PB2) R?#15.1 R?#17.2 ; port ENCB_CH1
ENCB_CH2: IC?#2.29(PB10) R?#16.1 R?#18.2 ; port ENCB_CH2
GPIO0: R?#1.1 SW?#1.3 U?#2.15(GPIO0) ; port GPIO0
GPIO2: R?#9.1 U?#2.14(GPIO2) ; port GPIO2
GPIO4: P?#4.3 U?#2.16(GPIO4) ; port GPIO4
GPIO16: P?#4.1 U?#2.8(XPD_DCDC) ; port GPIO16
I2C1_SCL: IC?#2.58(PB6) P?#2.3 ; port I2C1_SCL
I2C1_SDA: IC?#2.59(PB7) P?#2.5 ; port I2C1_SDA
I2C3_SCK: IC?#2.40(PA8) P?#1.3 ; port I2C3_SCK
I2C3_SDA: IC?#2.39(PC9) P?#1.4 ; port I2C3_SDA
LNA: C?#19.2 L?#2.2 U?#2.2(LNA) ; port LNA
M1_ENA: IC?#2.37(PC6) P?#3.7 ; port M1_ENA
M1_IN1: IC?#2.42(PA10) P?#3.5 ; port M1_IN1
M1_IN2: IC?#2.43(PA11) P?#3.3 ; port M1_IN2
M2_ENB: IC?#2.41(PA9) P?#3.8 ; port M2_ENB
M2_IN3: IC?#2.44(PA12) P?#3.6 ; port M2_IN3
M2_IN4: IC?#2.45(PA13) P?#3.4 ; port M2_IN4
MCU_RXD: Q?.3(D) ; port MCU_RXD
MCU_TXD: R?#24.1 U?#2.26(U0TXD) ; port URXD, port MCU_TXD
OSC_IN: C?#26.2 IC?#2.5(PH0-OSC_IN) Y?#2.1 ; port OSC_IN
OSC_OUT: IC?#2.6(PH1-OSC_OUT) R?#27.2 ; port OSC_OUT
PB0_PWM: IC?#2.26(PB0) P?#5.8 ; port PB0_PWM
PB1_PWM: IC?#2.27(PB1) P?#5.6 ; port PB1_PWM
PIN13: R?#5.1 U?#2.13(MTDO) ; port PIN13
RES12K: R?#6.2 U?#2.31(RES12K) ; port RES12K
reset: IC?#2.7(NRST) P?#5.3 ; port reset
RGB_B: R?#25.2 U?#2.9(MTMS) ; port RGB_B
RGB_G: R?#23.2 U?#2.10(MTDI) ; port RGB_G
RGB_R: R?#22.2 U?#2.12(MTCK) ; port RGB_R
RST: R?#10.1 U?#2.32(EXT_RSTB) ; port RST
SD_CLK_1: R?#2.2 U?#2.21(SDIO_CLK) ; port SD_CLK_1
SD_CMD: IC?#1.1(~{CS}) U?#2.20(SDIO_CMD) ; port SD_CMD
SD_D0: IC?#1.2(DO_(IO1)) U?#2.22(SDIO_DATA_0) ; port SD_D0
SD_D1: IC?#1.3(~{WP_(IO2)}) IC?#1.5(DI_(IO0)) U?#2.19(SDIO_DATA_3) U?#2.23(SDIO_DATA_1) ; port SD_D1
SD_D2: IC?#1.7(~{HOLD_OR_}RESET_(IO3)) U?#2.18(SDIO_DATA_2) ; port SD_D2
SPI1_CS: IC?#2.20(PA4) U?#4.12(CS) ; port SPI1_CS
SPI1_MISO: IC?#2.22(PA6) U?#4.1(SDO/SA0) ; port SPI1_MISO
SPI1_MOSI: IC?#2.23(PA7) U?#4.14(SDA) ; port SPI1_MOSI
SPI1_SCK: IC?#2.21(PA5) U?#4.13(SCL) ; port SPI1_SCK
SPI2_CS: IC?#2.33(PB12) P?#1.5 ; port SPI2_CS
SPI2_MISO: IC?#2.35(PB14) P?#1.6 ; port SPI2_MISO
SPI2_MOSI: IC?#2.36(PB15) P?#1.8 ; port SPI2_MOSI
SPI2_SCK: IC?#2.34(PB13) P?#1.7 ; port SPI2_SCK
TOUT: P?#4.5 U?#2.6(TOUT) ; port TOUT
UART5_RX: IC?#2.54(PD2) P?#2.4 ; port UART5_RX
UART5_TX: IC?#2.53(PC12) P?#2.6 ; port UART5_TX
USART2_RX: IC?#2.17(PA3) P?#5.4 ; port USART2_RX
USART2_TX: IC?#2.16(PA2) P?#5.7 ; port USART2_TX
UTXD: R?#26.2 U?#2.25(U0RXD) ; port UTXD
UTXD-ON: Q?.1(G) R?#28.2 R?#29.2 U?#2.24(GPIO5) ; port UTXD-ON
VCAP1: C?#18.1 IC?#2.30(VCAP_1) ; port VCAP1
VCAP2: C?#17.1 IC?#2.46(VCAP_2) ; port VCAP2
VDD3P3 - 3: L?#1.2 U?#2.3(VDD3P3) U?#2.4(VDD3P3) ; port VDD3P3 - 3, port VDD3P3 - 4
XTAL_IN: C?#6.1 U?#2.28(XTAL_IN) Y?#1.1(X1) ; port XTAL_IN
XTAL_OUT: C?#2.1 U?#2.27(XTAL_OUT) Y?#1.3(X2) ; port XTAL_OUT
Net*?_1: *?.1(LNA) C?#19.1 C?#21.2
NetC?#1_2: C?#1.2 IC?#1.8(VCC)
NetC?#27_2: C?#27.2 R?#27.1 Y?#2.3
NetD?_2: D?.2(Red_C) R?#21.1
NetD?_3: D?.3(Blue_C) R?#23.1
NetD?_4: D?.4(Green_C) R?#25.1
NetIC?#1_6: IC?#1.6(CLK) R?#2.1
NetQ?_2: Q?.2(S) R?#26.1 R?#30.2
NetR?#3_2: R?#3.2 SW?#1.2
NetR?#11_1: R?#11.1 R?#13.2
NetR?#12_1: R?#12.1 R?#14.2
NetR?#17_1: R?#17.1 R?#19.2
NetR?#18_1: R?#18.1 R?#20.2
NetR?#21_2: R?#21.2 R?#22.1

Not connected (* = marked no-connect by the designer): IC?#2 2(PC13) 3(PC14-OSC32_IN) 4(PC15-OSC32_OUT) 8(PC0) 9(PC1) 10(PC2) 11(PC3) 38(PC7) 49(PA14) 50(PA15) 51(PC10) 52(PC11) 55(PB3) 56(PB4) 57(PB5) 61(PB8) 62(PB9); P?#4 4; P?#5 5; SW?#1 1 4; SW?#2 1 4; U?#2 5(VDD_RTC) 11(VDDPST) 17(VDDPST); U?#4 4(INT1) 9(INT2) 10(OCS_Aux) 11(SDO_Aux); Y?#2 2(GND) 4(GND)

## Notes on the sheet
- ESP8266EX
- Netzteil Spannungsversorgung
- (near D?) RED
- (near D?) BLUE
- (near D?) GREEN
- (in symbol CMP-05427-002132-1) +

## Library data of the parts
*? = CMP-00025-00004-3
C?#1 = CMP-2007-04174-2: General Purpose Ceramic Capacitor, 0805, 100nF, 10%, X7R, 15%, 100V; Packaging: Tape and Reel; Min Operating Temperature: -55°C; Dielectric Material: Ceramic; Height: 1.4mm; Voltage Rating: 100V; Termination: SMD/SMT; Case Code (Imperial): 0805; Case Code (Metric): 2012; Case/Package: 0805; Construction: Flat; Radiation Hardening: No; Series: -; Dielectric: X7R; Package Quantity: 2000; Mount: Surface Mount; Capacitance: 100nF; Contact Plating: Tin; Voltage: 100V; Lead Free: Lead Free; Depth: 1.25mm; RoHS Compliant: Yes; Number of Pins: 2; Max Operating Temperature: 125°C; Length: 2.01mm; Voltage Rating (DC): 100V; Thickness: 0.055inch; REACH SVHC: No SVHC; Width: 0.049inch; Tolerance: 10%
C?#2 C?#6 = CMP-2006-03343-2: CAP CER 10PF 50V NP0 0603; Manufacturer: KEMET; Material: Ceramic; Temperature Coefficient: 30ppm/°C; Automotive Grade: Grade 1; Tolerance: 0.25 pF; Temperature Characteristic: C0G; Device Class L3: Ceramic Capacitors; Value: 10 pF; Device Class L1: Passive Components; Lead Free: Yes; RoHS: TRUE; Voltage Rating: 50 V; Automotive: Yes; Capacitance: 10 pF; Height: 0.87mm; Temperature Range Low: -55°C; Temperature Range High: +125°C; Mouser Description: Multilayer Ceramic Capacitors MLCC - SMD/SMT 50volts 10pF C0G 0.25%; Device Class L2: Capacitors; Digikey Description: CAP CER 10PF 50V NP0 0603; ComponentLink2Description: Datasheet; Package: C0603C-CF; ComponentLink2URL: https://api.kemet.com/component-edge/download/datasheet/C0603C100J5GACAUTO.pdf; Category: Cap; Octopart: https://octopart.com/c0603c100c5gactu-kemet-9138556; Manufacturer Part Number: C0603C100C5GACTU; Temperature: -55°C to +125°C
C?#3 = CMP-2007-03453-2: Chip Multilayer Ceramic Capacitors for General Purpose, 0805, 10uF, X5R, 15%, 10%, 16V; Radiation Hardening: No; Thickness: 0.053inch; Voltage Rating (DC): 16V; Lead Free: Lead Free; Package Quantity: 1; Width: 1.25mm; Case Code (Imperial): 0805; Depth: 1.25mm; Packaging: Tape and Reel; Dielectric: X5R; Max Operating Temperature: 85°C; Tolerance: 10%; Voltage Rating: 16V; Voltage: 16V; Capacitance: 10uF; Height: 1.25mm; Case Code (Metric): 2012; Material: Ceramic; Mount: Surface Mount; Case/Package: 0805; REACH SVHC: No SVHC; Length: 2mm; Min Operating Temperature: -55°C; Termination: SMD/SMT
C?#4 = CMP-001-00028-7: Aluminum Electrolytic Capacitor, 220 uF, +/- 20%, 50 V, -40 to 85 degC, 2-Pin THD, RoHS, Bulk; Manufacturer: Panasonic; Ripple Current (AC): 400mA; Voltage Rating: 50V; Case/Package: Radial; Packaging: Bulk; Package Quantity: 200; Min Operating Temperature: -40°C; Datasheet Version: Mar-16; Package Reference: CAPPR65-500-1250X1000X1350; Mounting Technology: TH; Ripple Current: 400mA; Pins: 2; Package Description: 2-Pin Radial Lead, Dia 10 mm, Body Length 12.5 mm; RoHS Compliant: True; Max Operating Temperature: 85°C; Lead Pitch: 5mm; Tolerance: 20%; Manufacturer URL: http://www.panasonic.com/; Diameter: 10mm; Capacitor Type: Electrolytic; Datasheet URL: http://industrial.panasonic.com/cdbs/www-data/pdf/RDF0000/DMF0000COL68.pdf
C?#5 C?#9 = CMP-05427-002132-1: CAP ALUM 47UF 20% 16V SMD; Dielectric Material: Aluminium; ESR (Equivalent Series Resistance): 700mR; Ripple Current: 160mA; Life (Hours): 2000Hour; Leakage Current: 3uA; Voltage: 10V; Length: 5.8mm; Voltage Rating: 16V; Ratings: AEC-Q200; Package Quantity: 1000; Min Operating Temperature: -55°C; Mount: Surface Mount; Width: 6.5mm; Voltage Rating (DC): 16V; Radiation Hardening: No; Diameter: 5mm; RoHS Compliant: Yes; Reach SVHC Compliant: Yes; Termination: SMD/SMT; Material: Aluminium; Ripple Current (AC): 160mA; Impedance: 700mR; Series: FK; Height - Seated (Max): 0.228inch; Packaging: Tape and Reel; Height: 5.8mm; Capacitance: 47uF; Contact Plating: Tin; Construction: Cylindrical; Number of Pins: 2; Lead Free: Lead Free; Tolerance: 20%; Max Operating Temperature: 105°C; Case/Package: Radial
C?#7 C?#8 C?#10 C?#11 C?#20 C?#22-C?#25 C?#28 = CMP-001-00018-6: Chip Capacitor, 100 nF, +/- 10%, 50 V, 0805 (2012 Metric); Capacitor Type: Ceramic; Voltage Rating: 50V; Pins: 2; Max Operating Temperature: 125°C; Min Operating Temperature: -55°C; Mounting Technology: SM; Case/Package: 0805; RoHS Compliant: True; Tolerance: 10%
C?#12 C?#15 = CMP-2007-03243-2: CAP CER 10UF 10V X5R 0805; Manufacturer: Kemet; 3DS Part Number: 220-00001; Tolerance: 10%; Temperature Coefficient: 15%; Material: Ceramic; Device Class L2: Capacitors; Device Class L1: Passive Components; ComponentLink2URL: https://content.kemet.com/datasheets/KEM_C1006_X5R_SMD.pdf; Height: 1.4mm; Lead Free: Yes; Manufacturer Part Number: C0805C106K8PACTU; Digikey Description: CAP CER 10UF 10V X5R 0805; Octopart: https://octopart.com/c0805c106k8pactu-kemet-98697; Capacitance: 10uF; Value: 10uF; Temperature Range Low: -55°C; Temperature: -55°C to +85°C; Automotive: No; Mouser Description: CAP CER 10UF 10V X5R 0805; Ipc Land Pattern Name: CAPC200125X125; Temperature Range High: +85°C; Voltage: 10V; RoHS: TRUE; Device Class L3: Ceramic Capacitors; ComponentLink2Description: Datasheet; Voltage Rating: 10V; Package: C0805C-DG; Temperature Characteristic: X5R; Category: Cap
C?#13 C?#14 = CMP-2007-03236-1: Manufacturer: Kemet; Part Number: C0805C105K5RACTU
C?#16 = CMP-03020-032188-1: CAP CER 0.1UF 10V 5% X7R 0805; Manufacturer: KEMET; Material: Ceramic; Tolerance: 0.05; Capacitance: 0.10 μF; Temperature Coefficient: 30ppm/°C; Value: 0.10 μF; Package: C0805C-DN; Device Class L1: Passive Components; Temperature: -55°C to +125°C; Category: Cap; RoHS: TRUE; Mouser Description: Multilayer Ceramic Capacitors MLCC - SMD/SMT 10volts 0.1uF X7R 5%; Lead Free: Yes; Temperature Range Low: -55°C; Temperature Range High: +125°C; Device Class L2: Capacitors; Temperature Characteristic: X7R; Device Class L3: Ceramic Capacitors; ComponentLink2Description: Datasheet; Automotive: No; Ipc Land Pattern Name: CAPC200125X78; Manufacturer Part Number: C0805C104J8RACTU; Voltage Rating: 10 V; Height: 0.88mm; Digikey Description: CAP CER 0.1UF 10V 5% X7R 0805; Octopart: https://octopart.com/c0805c104j8ractu-kemet-11807087; ComponentLink2URL: https://content.kemet.com/datasheets/KEM_C1003_C0G_SMD.pdf
C?#17 C?#18 = CMP-2000-05810-2: General Purpose Ceramic Capacitor, 0805, 2.2uF, 10%, X5R, 15%, 10V; Insulation Resistance: 500MR; Dissipation Factor: 5%; Termination: SMD/SMT; Length: 2.01mm; Lead Free: Lead Free; Voltage: 10V; Height: 1.4mm; Contact Plating: Tin; Dielectric: X5R; Voltage Rating (DC): 10V; REACH SVHC: No SVHC; Voltage Rating: 10V; Depth: 1.25mm; Min Operating Temperature: -55°C; Tolerance: 10%; Case Code (Metric): 2012; Max Operating Temperature: 85°C; Radiation Hardening: No; Dielectric Material: Ceramic; Packaging: Tape and Reel; Construction: Flat; Case Code (Imperial): 0805; RoHS Compliant: Yes; Package Quantity: 1; Capacitance: 2.2uF; Series: -; Size: 1.4mm; Number of Pins: 2; Width: 0.049inch; Mount: Surface Mount; Thickness: 0.055inch; Case/Package: 0805
C?#19 = CMP-2006-03332-2: CAP CER 8.2PF 50V NP0 0603; Manufacturer: KEMET; Temperature Coefficient: 30ppm/°C; Temperature Characteristic: C0G; Material: Ceramic; Tolerance: 0.25 pF; Automotive Grade: Grade 1; Octopart: https://octopart.com/c0603c829c5gactu-kemet-8375751; Automotive: Yes; RoHS: TRUE; Manufacturer Part Number: C0603C829C5GACTU; Temperature Range High: +125°C; Category: Cap; Digikey Description: CAP CER 8.2PF 50V NP0 0603; Value: 8.2 pF; Temperature: -55°C to +125°C; Package: C0603C-CF; Device Class L1: Passive Components; Device Class L3: Ceramic Capacitors; Device Class L2: Capacitors; ComponentLink2Description: Datasheet; Height: 0.87mm; Capacitance: 8.2 pF; Lead Free: Yes; Voltage Rating: 50 V; Mouser Description: Multilayer Ceramic Capacitors MLCC - SMD/SMT 50volts 8.2pF C0G 0.25%; ComponentLink2URL: https://api.kemet.com/component-edge/download/datasheet/C0603C100J5GACAUTO.pdf; Temperature Range Low: -55°C
C?#21 = CMP-03020-011124-1: CBR0402 2.4 pF 30ppm/°C 0.1 pF C0G 50 V; Manufacturer: KEMET; Capacitance: 2.4 pF; Material: Ceramic; Tolerance: 0.1 pF; Value: 2.4 pF; Voltage Rating: 50 V; Ipc Land Pattern Name: CAPC10050X50; Device Class L3: Ceramic Capacitors; ComponentLink2Description: Datasheet; Category: Cap; Octopart: https://octopart.com/cbr04c249b5gac-kemet-75200062; Temperature Characteristic: C0G; ComponentLink2URL: https://content.kemet.com/datasheets/KEM_C1030_CBR_SMD.pdf; Height: 0.55mm; RoHS: TRUE; Manufacturer Part Number: CBR04C249B5GAC; Package: CBR04C; Temperature Range High: +125°C; Temperature Range Low: -55°C; Temperature: -55°C to +125°C; Device Class L2: Capacitors; Temperature Coefficient: 30ppm/°C; Automotive: No; Lead Free: Yes; Device Class L1: Passive Components
C?#26 C?#27 = CMP-2007-04621-1: Manufacturer: AVX Interconnect / Elco; Part Number: 08055A150JAT2A
D? = CMP-2000-07119-2: LED RGB CLEAR SMD; Test Current: 2mA; Wavelength: 465nm; Color: Blue; Lens Style: Square; Power Rating: 30mW; Lens Color: Colorless; Number of LEDs: 3; Viewing Angle: 120°; Luminous Intensity: 20mcd; Forward Voltage: 2.73V; Height: 0.3mm; Lead Free: Lead Free; Max Operating Temperature: 85°C; Mount: Surface Mount; REACH SVHC: No SVHC; Case Code (Imperial): 0404; Forward Current: 2mA; Case Code (Metric): 1010; Lens Transparency: Clear; Length: 1mm; Packaging: Tape and Reel; Min Operating Temperature: -40°C; Package Quantity: 2000; Case/Package: 0404; Width: 1mm
IC?#1 = W25Q128JVSQ: Integrated Circuit; Manufacturer_Name: Winbond; Datasheet Link: https://www.winbond.com/hq/support/documentation/levelOne.jsp?__locale=en&DocNo=DA00-W25Q128JV; Height: 2.16mm; Manufacturer_Part_Number: W25Q128JVSQ
IC?#2 = STM32H7A3RIT6: Integrated Circuit; Manufacturer_Name: STMicroelectronics; Datasheet Link: https://www.st.com/resource/en/datasheet/stm32h7a3ai.pdf; Height: 1.6mm; Manufacturer_Part_Number: STM32H7A3RIT6; Mouser Part Number: 511-STM32H7A3RIT6; Mouser Price/Stock: https://www.mouser.co.uk/ProductDetail/STMicroelectronics/STM32H7A3RIT6?qs=xZ%2FP%252Ba9zWqZAEQXxnLVEdg%3D%3D; Arrow Part Number: STM32H7A3RIT6; Arrow Price/Stock: https://www.arrow.com/en/products/stm32h7a3rit6/stmicroelectronics
J?#1 J?#6 = CMP-1502-02458-2: NexarPartId: 105950651
J?#2-J?#5 J?#7 = CMP-1502-02464-2: NexarPartId: 18818288; Plating: Brass, Steel; Current: 10A; Pitch: 3.5052mm; Number of Levels: 1; Number of Contacts: 2; Wire Gauge (Min): 16AWG; Voltage: 300V; Wire Gauge (Max): 24AWG; Stripping Length: -6mm; Number of Pins: 2; Number of Rows: 1; REACH SVHC: Unknown; RoHS: Compliant; Housing Material: Nylon; Termination: Screw; Mount: Through Hole; Contact Plating: Brass, Tin; Number of Positions Per Level: 2; Color: Blue, Green; Width: 7.9mm; Voltage Rating: 300V; Length: 7.4mm; Current Rating: 10A; Wire/Cable Gauge: 24AWG; Packaging: Box; Max Operating Temperature: 105°C; Lead Pitch: 3.5mm; Height: 8.7mm; Contact Material: Brass; Min Operating Temperature: -40°C
L?#1 = CMP-06042-008021-1: Wire Wound RF Inductor 4.3nH ±0.2nH 850mA 0.059Ω 0603 (1608); Self Resonant Frequency: 6GHz; Series Resistance: 59mR; Shielding: Unshielded; Test Frequency: 100MHz; Current: 750mA; Core Material: Non-Magnetic; Q Factor: 35; Case Code (Imperial): 0603; Mount: Surface Mount; Radiation Hardening: No; Height: 0.8mm; Width: 0.031inch; Length: 1.6mm; Height - Seated (Max): 0.039inch; Current Rating: 850mA; Resistor Type: Wirewound; Package Quantity: 4000; Depth: 1mm; DC Resistance (DCR): 59mR; Termination: SMD/SMT; Max Operating Temperature: 125°C; Military Standard: Not; Min Operating Temperature: -55°C; Case Code (Metric): 1608; DC Current: 850mA; Packaging: Tape and Reel; Inductance: 4.3nH; Max DC Current: 850mA; REACH SVHC: No SVHC; Case/Package: 0603; Weight: 0.000106oz
L?#2 = CMP-03913-120013755-1: 7447840015G Multilayer Inductor, 1.5Nh, 0.3A, 0402 Rohs Compliant: Yes; Current Rating: 300mA; Width: 500µm; Length: 1mm; Height: 500µm; Max Operating Temperature: 125°C; RoHS: Compliant; Ambient Temperature Range High: 105°C; NexarPartId: 120013755; Inductance: 1.5nH; Ambient Temperature Range Low: -55°C; Min Operating Temperature: -55°C
P?#1-P?#3 P?#5 = CMP-1502-01084-3: NexarPartId: 18818163; Connector Type: Male Pin; Insulation Resistance: 1GΩ; Row Spacing: 2.54mm; Insulation: Insulated; Number of Positions: 10; Current Rating: 3A; Voltage Rating: 250V; Gender: Male; Contact Resistance: 20mΩ; Contact Gender: Male; Number of Rows: 2; Min Operating Temperature: -40°C; Mount: Through Hole; Packaging: Bulk; Length: 12.7mm; Pitch: 2.54mm; RoHS: Compliant; Height: 2.54mm; Lead Pitch: 2.54mm; Number of Pins: 10; Housing Material: PBT; Orientation: Vertical; Flammability Rating: UL94 V-0; Termination: Through Hole; Width: 12.7mm; Color: Black; Contact Mating Length: 5.9944mm; Max Operating Temperature: 105°C; Operating Supply Voltage: 250V; Contact Material: Copper; Number of Contacts: 10; Contact Plating: Gold; REACH SVHC: Unknown
P?#4 = CMP-1502-01071-4: NexarPartId: 32855528; Contact Resistance: 20mΩ; Current Rating: 3A; Operating Supply Voltage: 250V; Row Spacing: 2.54mm; Connector Type: Male Pin; Gender: Male; Number of Contacts: 6; Contact Mating Length: 5.9944mm; Number of Rows: 2; REACH SVHC: Unknown; RoHS: Compliant; Termination: Solder; Height: 5.23mm; Number of Pins: 6; Voltage Rating: 250V; Packaging: Bulk; Lead Pitch: 2.54mm; Mount: Through Hole; Max Operating Temperature: 105°C; Color: Black; Number of Positions: 6; Contact Material: Copper; Contact Plating: Gold; Min Operating Temperature: -40°C; Pitch: 2.54mm
Q? = DMN2041L-7: MOSFET (N-Channel); Manufacturer_Name: Diodes Incorporated; Datasheet Link: https://www.diodes.com//assets/Datasheets/products_inactive_data/DMN2041L.pdf; Height: 1.1mm; Manufacturer_Part_Number: DMN2041L-7; Mouser Part Number: 621-DMN2041L-7; Mouser Price/Stock: https://www.mouser.co.uk/ProductDetail/Diodes-Incorporated/DMN2041L-7?qs=tiksPeNXt0LSbn3jTreVOg%3D%3D; Arrow Part Number: DMN2041L-7; Arrow Price/Stock: https://www.arrow.com/en/products/dmn2041l-7/diodes-incorporated?region=nac
R?#1 R?#4 R?#5 R?#9 R?#24 R?#28-R?#30 = CMP-009-00018-5: Chip Resistor, 10 KOhm, +/- 1%, 125 mW, -55 to 155 degC, 0805 (2012 Metric); Power: 125mW; Voltage Rating: 150V; Tolerance: 1%; Pins: 2; Min Operating Temperature: -55°C; Case/Package: 0805; Max Operating Temperature: 155°C; RoHS Compliant: True; Mounting Technology: SM
R?#2 = CMP-2001-03663-1: Manufacturer: Vishay Dale; Part Number: CRCW0805200RFKEA
R?#3 = CMP-2001-03932-1: Manufacturer: Vishay Dale; Part Number: CRCW0805470RFKEA
R?#6 = CMP-2001-00513-1: Manufacturer: Panasonic; Part Number: ERJ6ENF1202V
R?#7 R?#8 R?#15 R?#16 = CMP-2001-00582-2: Metal Film Chip Resistor, High Reliability Type, 0.125 W, +/- 0.1%, -55 to 155 degC, 0805 (2012 Metric), RoHS, Tape and Reel; Voltage Rating: 100V; Power Rating: 125mW(1/8W); Brand: Panasonic; Temperature Coefficient: 25PPM/C; Resistance: 10kOhms; Product Category: ThinFilmResistors-SMD; Datasheet Version: 02/2016; Operating Temperature Range: -55Cto+155C; Length: 2mm; Mounting Technology: SurfaceMount; Manufacturer URL: http://www.panasonic.com/; Width: 1.25mm; Packaging: Reel; Product: ThinFilmResistorsSMD; Package / Case: 0805(2012metric); Termination Style: SMD/SMT; Tolerance: 0.1%; Datasheet URL: https://industrial.panasonic.com/cdbs/www-data/pdf/RDM0000/AOA0000C307.pdf; Package Description: 2-Pin Surface Mount Device, Body 2 x 1.25 mm; Factory Pack Quantity: 5000; Series: ERA-6A; Case Code - mm: 2012; RoHS: Details; Package Reference: 0805; Height: 0.5mm; Manufacturer: Panasonic; Case Code - in: 0805; Type: MetalFilmChipResistors
R?#10 = CMP-03211-006924-1: SMD Chip Resistor, Thin Film, 12KΩ, 100 V, 0805 [2012 Metric], 100 mW, 0.1%, RN73 Series; Manufacturer: TE Connectivity; Power Rating: 0.1W; Temperature Coefficient: 10ppm/°C; Voltage Rating: 100V; Device Class L1: Passive Components; Device Class L2: Resistors; RoHS: TRUE; Temperature Range Low: -55°C; Tolerance: 0.1%; Temperature: -55°C to 155°C; Value: 12KΩ; packaging: 250 cut tape length; Lead Free: Yes; Height: 0.65mm; Ipc Land Pattern Name: RESC200125X55; Automotive: No; Category: Res; ComponentLink2Description: Datasheet; Device Class L3: Chip SMD Resistors; Manufacturer Part Number: RN73C2A12KBTG; Series: RN73; Temperature Range High: 155°C; octopart_url: https://octopart.com/rn73c2a12kbtg-te+connectivity-22737727; Package: RN732A; ComponentLink2URL: https://www.te.com/commerce/DocumentDelivery/DDEController?Action=showdoc&DocId=Data+Sheet%7F1773270%7FP%7Fpdf%7FEnglish%7FENG_DS_1773270_P.pdf%7F1676162-2; Resistance: 12KΩ; Octopart: https://octopart.com/rn73c2a12kbtg-te+connectivity-22737727; Composition: Thin Film
R?#11 R?#12 R?#17 R?#18 = CMP-2001-00644-1: Manufacturer: Panasonic; Part Number: ERA6AEB472V
R?#13 R?#14 R?#19 R?#20 = CMP-2001-00581-2: RES 1K OHM 0.1% 1/8W 0805; Temperature Coefficient: 25ppm/°C; Resistance: 1kR; Working Voltage: 100V; Max Power Dissipation: 125mW; Height: 0.5mm; Technology: THIN FILM; REACH SVHC: No SVHC; Packaging: Tape and Reel; Length: 2mm; Width: 1.25mm; Resistance Tolerance: 0.1%; Series: ERA-6A; Resistor Type: Thin Film; Number of Pins: 2; Case Code (Metric): 2012; Voltage Rating: 100V; Radiation Hardening: No; Construction: Rectangular; Mount: Surface Mount; Number of Terminations: 2; Case/Package: 0805; Min Operating Temperature: -55°C; Military Standard: Not; RoHS Compliant: Yes; Termination: SMD/SMT; Case Code (Imperial): 0805; Depth: 1.25mm; Power Rating: 125mW; Max Operating Temperature: 155°C; Contact Plating: Tin; Package Quantity: 5000; Tolerance: 0.1%
R?#21 = CMP-2001-00580-1: Manufacturer: Panasonic; Part Number: ERA6AEB101V
R?#22 = CMP-2001-00076-1: Manufacturer: Panasonic; Part Number: ERJ-6ENF24R9V
R?#23 = CMP-2001-03692-2: RES Thick Film, 22Ω, 1%, 0.125W, 100ppm/°C, 0805; Resistance: 22R; Power Rating: 125mW; Voltage Rating: 150V; Case/Package: 0805; Radiation Hardening: No; Number of Terminations: 2; Termination: SMD/SMT; Package Quantity: 5000; Weight: 0.000194oz; Mount: Surface Mount; Lead Free: Lead Free; Height: 0.45mm; Composition: Thick Film; Min Operating Temperature: -55°C; Case Code (Metric): 2012; Temperature Coefficient: 100ppm/°C; Depth: 1.25mm; Packaging: Tape and Reel; Contact Plating: Tin; Width: 1.25mm; Case Code (Imperial): 0805; Length: 2mm; Max Operating Temperature: 155°C; Tolerance: 1%; Features: Automotive AEC-Q200; Military Standard: Not; Voltage Rating (DC): 150V; Max Power Dissipation: 125mW
R?#25 = CMP-2001-00211-2: RES SMD 499 OHM 1% 1/8W 0805; Temperature Coefficient: 100ppm/°C; Working Voltage: 150V; Power Rating: 125mW; Resistance: 499R; Case/Package: 0805; Mount: Surface Mount; Height: 0.6mm; Resistor Type: Thick Film; Length: 2mm; Depth: 1.25mm; Tolerance: 1%; REACH SVHC: No SVHC; RoHS Compliant: Yes; Case Code (Imperial): 0805; Min Operating Temperature: -55°C; Contact Plating: Tin; Lead Free: Lead Free; Construction: Rectangular; Technology: THICK FILM; Termination: SMD/SMT; Features: Automotive AEC-Q200; Case Code (Metric): 2012; Resistance Tolerance: 1%; Voltage Rating: 150V; Max Operating Temperature: 155°C; Series: ERJ; Packaging: Tape and Reel; Radiation Hardening: No; Military Standard: Not; Voltage Rating (DC): 150V; Package Quantity: 1; Max Power Dissipation: 125mW; Number of Terminations: 2; Width: 0.049inch
R?#26 = CMP-2001-04775-1: Manufacturer: Vishay Dale; Part Number: TNPW0805499RBEEN
R?#27 = CMP-009-00007-5: Chip Resistor, 0 Ohm, 0.125 W, -55 to 155 degC, 0805 (2012 Metric); Power: 125mW; Voltage Rating: 50V; RoHS Compliant: True; Max Operating Temperature: 155°C; Case/Package: 0805; Mounting Technology: SM; Min Operating Temperature: -55°C; Tolerance: 5%; Pins: 2
SW?#1 SW?#2 = CMP-2000-05160-2: SWITCH TACTILE SPST-NO 0.05A 12V; Contact Resistance: 100mR; Throw Configuration: SPST; Illumination Type: Non-Illuminated; Mechanical Life: 100000Cycles; Current Rating: 50mA; Switch Function: Off-Mom; Actuator Length: 0.85mm; Actuator Material: Nylon; Actuator Type: Standard; Operating Force: 160gf; Min Operating Temperature: -20°C; REACH SVHC: No SVHC; Termination: Gull Wing; Case/Package: SMD/SMT; Packaging: Tape and Reel; Mount: Surface Mount; Voltage Rating (DC): 12V; Orientation: Straight; Lead Free: Lead Free; Contact Material: Silver; Color: Black; Max Current Rating: 50mA; Contact Plating: Silver; Depth: 9mm; Package Quantity: 1; Max Voltage Rating (DC): 12V; Length: 6mm; Max Operating Temperature: 60°C
U?#1 = CMP-2000-05426-2: NexarPartId: 9539342; Nominal Output Voltage: 3.3V; Max Input Voltage: 36V; Max Output Power: 3.3W; Min Input Voltage: 4.75V; Nominal Supply Current: 1mA; Output Type: Fixed; Max Output Current: 1A; Min Input Voltage (DC): 5.5V; Efficiency: 79%; Number of Outputs: 1; Isolation: Isolated; Max Input Voltage (DC): 32V; Switching Frequency: 500kHz; Radiation Hardening: No; REACH SVHC: No SVHC; Mount: Through Hole; Height: 10.2mm; Max Operating Temperature: 85°C; RoHS: Compliant; Output Power: 3.3W; Min Supply Voltage: 4.75V; Weight: 1.9g; Power Rating: 3.3W; Number of Pins: 3; Output Current: 1A; Min Operating Temperature: -40°C; Length: 11.7mm; Case/Package: SIP; Output Voltage: 3.3V; Max Supply Voltage: 36V; Depth: 7.6mm; Width: 7.6mm
U?#2 = CMP-2000-07453-1: Low-Power, Highly-Integrated Wi-Fi Solution, 2.5 to 3.6 V, 80 mA, -40 to 125 degC, 32-Pin QFN; Manufacturer: Espressif Systems; Mounting Technology: SurfaceMount; Datasheet URL: http://espressif.com/sites/default/files/documentation/0a-esp8266ex_datasheet_en.pdf; Package Reference: QFN-32; Package Description: 32-Pin Quad Falt No-Lead, Body 5 x 5 mm, Pitch 0.5 mm; Manufacturer URL: http://espressif.com; Datasheet Version: Rev. 5.4, 04/2017
U?#3 = CMP-2000-05427-1: DC/DC converter, 5 VDC, 1000 mA, -40 to 85 degC, 3-Pin SIP, RoHS; Manufacturer: Tracopower; Output Voltage Nom.: 5V; Output Current Max: 1A; Product Range: TSR-1Series; DC / DC Converter Mounting: ThroughHole; Output Power Max: 5W; No. of Outputs: 1Output; Input Voltage DC Max: 36V; Approvals & Standards: IEC,UL; Input Voltage DC Min: 6.5V; DC / DC Converter Output Type: Fixed; Depth: 11.7mm; Package Reference: SIP-3; DC / DC Converter Type: SIP; Height: 10.2mm; Width: 7.6mm; Package Description: 3-Pin Single In-line Package, Body 11.7 x 7.6 mm, Pitch 2.54 mm; Manufacturer URL: http://www.tracopower.com/home; Datasheet Version: Jan-15; Datasheet URL: https://datasheet.ciiva.com/6815/tsr1-6815641.pdf
U?#4 = CMP-12177-000010-1: INEMO INERTIAL MODULE: 3D ACCELE; Manufacturer: STMicroelectronics; Sensor Type: Temperature,Accelerometer,Gyroscope; Accel Range: 2/4/8/16g; Accel Sensitivity: 0.061/0.122/0.244/0.488mV/g; Operating Supply Current: 0.55mA; Gyro Range: 125/250/500/1000/2000°/s; Gyro Sensitivity: 4.375/8.75/17.5/35/70LSB/°/s; Sensor Output: I2C,SPI,Other; Min Supply Voltage: 1.62V; Max Supply Voltage: 3.6V; Octopart: https://octopart.com/lsm6dsoxtr-stmicroelectronics-98102600; Package: LGA-14L-DM00249496; Footprint Url: https://www.st.com/content/ccc/resource/technical/document/technical_note/73/17/9c/16/dd/96/4a/01/CD00134799.pdf/files/CD00134799.pdf/jcr:content/translations/en.CD00134799.pdf; ComponentLink2Description: Datasheet; Mouser Description: LSM6DSOX: 3.6 V 3 Axis Accelerometer Gyroscope iNEMO Inertial Module - LGA-14L; ComponentLink2URL: https://www.st.com/resource/en/datasheet/lsm6dsox.pdf; Temperature Range Low: -40°C; Digikey Description: INEMO INERTIAL MODULE: 3D ACCELE; Lead Free: Yes; Device Class L3: Inertial Measurement Units (IMUs); Category: IC; Device Class L2: Motion Sensors; RoHS: TRUE; Temperature: -40°C to +85°C; Height: 0.86mm; Device Class L1: Sensors; Temperature Range High: +85°C; Manufacturer Part Number: LSM6DSOXTR; Automotive: No
Y?#1 = ABM8-26.000MHZ-B2-T: Crystal or Oscillator; Manufacturer_Name: ABRACON; Datasheet Link: https://abracon.com/Resonators/abm8.pdf; Height: 0.8mm; Manufacturer_Part_Number: ABM8-26.000MHZ-B2-T
Y?#2 = CMP-27762-015716-1: Crystal 24MHz ±20ppm (Tol) ±50ppm (Stability) 12pF FUND 50Ω Automotive 4-Pin Ultra Mini-CSMD T/R; ESR (Equivalent Series Resistance): 50R; Series: ABM8AIG; RoHS Compliant: Yes; Load Capacitance: 12pF; Height: 0.031inch; Min Operating Temperature: -40°C; Mount: Surface Mount; Packaging: Cut Tape; Ratings: AEC-Q200; Case/Package: SMD/SMT; Frequency Stability: 50ppm; Max Operating Temperature: 125°C; Length: 0.126inch; Frequency: 24MHz; Frequency Tolerance: 20ppm; Width: 0.098inch